# Altium schematic sheet Main.SchDoc
size A4; SheetNumber: 1; SheetTotal: 1
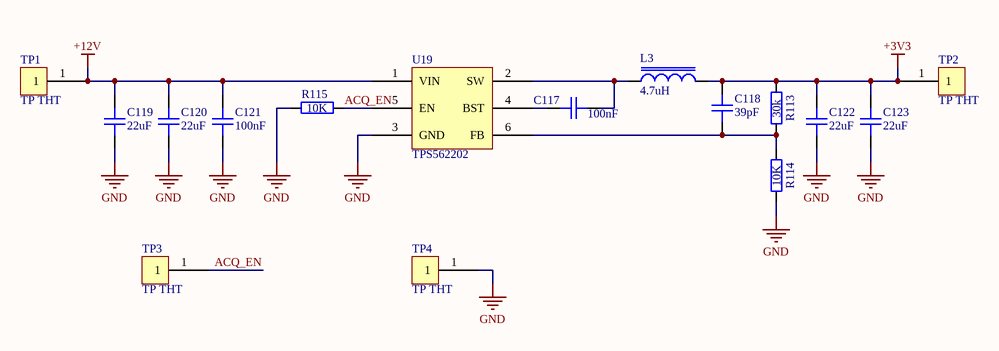
[diagram p0: Main.SchDoc]

## Parts
C117  100nF  [GEN_C_0402]
C118  39pF  [GEN_C_0402]
C119  22uF  [GEN_C_0805]
C120  22uF  [GEN_C_0805]
C121  100nF  [GEN_C_0402]
C122  22uF  [GEN_C_0805]
C123  22uF  [GEN_C_0805]
L3  4.7uH  [TY_IND_NRS5030]
R113  30k  [GEN_R_0402]
R114  10K  [GEN_R_0402]
R115  10K  [GEN_R_0402]
TP1  TP THT  [GEN_1_Pin_TH_TP]
TP2  TP THT  [GEN_1_Pin_TH_TP]
TP3  TP THT  [GEN_1_Pin_TH_TP]
TP4  TP THT  [GEN_1_Pin_TH_TP]
U19  TPS562202  [TI_SOT563_DRL0006A]

## Nets
+3V3: C118.2 C122.2 C123.2 L3.2 R113.2 TP2.1
+12V: C119.2 C120.2 C121.1 TP1.1 U19.1(VIN)
GND: C119.1 C120.1 C121.2 C122.1 C123.1 R114.1 R115.2 TP4.1 U19.3(GND)
ACQ_EN: R115.1 TP3.1 U19.5(EN)
NetC117_1: C117.1 L3.1 U19.2(SW)
NetC117_2: C117.2 U19.4(BST)
NetC118_1: C118.1 R113.1 R114.2 U19.6(FB)

## Library data of the parts
C117 C121 = CAP 100nF 16V X7R 0402: House Part Number: C-100nF-0402-002; Manufacturer: Murata; Manufacturer Part Number: GCM155R71C104KA55D; Voltage Rating: 16V; Package: 0402; Supplier 1: Mouser; Supplier Part Number 1: 81-GCM155R71C104KA5D; Value: 100nF
C118 = CAP 39pF 50V C0G 0402: Manufacturer: KEMET; House Part Number: C-39pF-0402-002; Manufacturer Part Number: C0402C390J5GACTU; Temperature Coefficient: C0G; Voltage Rating: 50V; Package: 0402; Value: 39pF; Supplier 1: Mouser; Supplier Part Number 1: 80-C0402C390J5G
C119 C120 C122 C123 = CAP 22uF 25V X5R 0805: House Part Number: C-22uF-0805-002; Manufacturer: Murata; Manufacturer Part Number: GRM21BR61E226ME44L; Voltage Rating: 25V; Package: 0805; Value: 22uF; Supplier 1: Mouser; Supplier Part Number 1: 81-GRM21BR61E226ME4L
L3 = IND 4.7uH 2.6A 35 MOHM SMD: Manufacturer: Taiyo Yuden; Manufacturer Part Number: NRS5030T4R7MMGJ; Value: 4.7uH; Supplier 1: Mouser; Supplier Part Number 1: 963-NRS5030T4R7MMGJ
R113 = RES 30K OHM 1% 1/16W 0402: Manufacturer: Yageo; Manufacturer Part Number: RC0402FR-0730KL; Tolerance: 1%; Package: 0402; Value: 30k; Supplier 1: Mouser; Supplier Part Number 1: 603-RC0402FR-0730KL
R114 R115 = RES 10K OHM 1% 1/10W 0402: Manufacturer: Panasonic; Manufacturer Part Number: ERJ-2RKF1002X; Tolerance: 1%; Package: 0402; Supplier 1: Mouser; Supplier Part Number 1: 667-ERJ-2RKF1002X; Value: 10K
U19 = IC BUCK TPS562202: Supplier 1: Texas Instruments; Supplier Part Number 1: TPS562202DRLR